# EAGLE design robber_v02 (EAGLE 8.3.1)
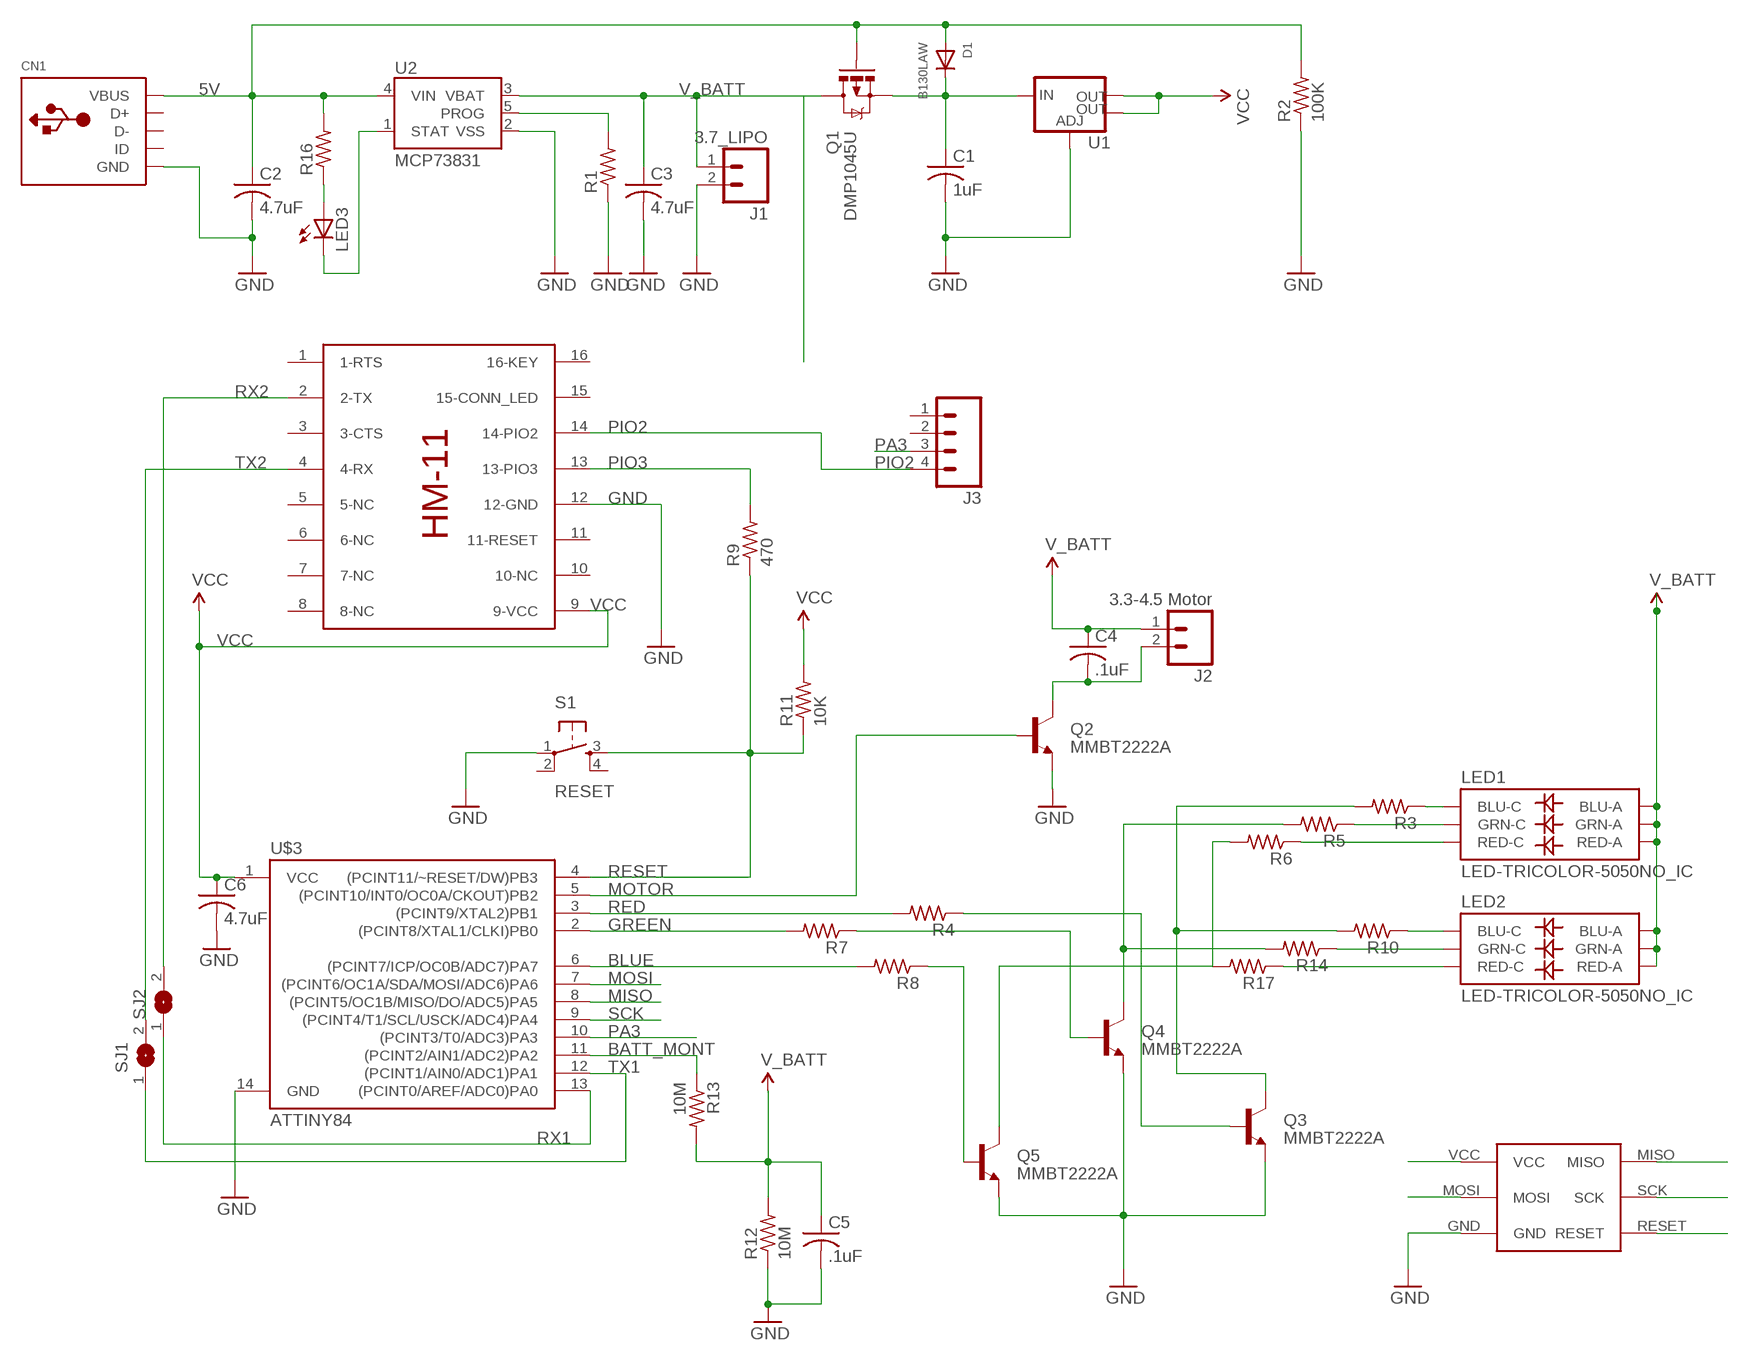
[diagram p0: schematic, sheet 1]

## Parts
C1  1uF  C-USC0805K  [C0805K]
C2  4.7uF  C-USC0805K  [C0805K]
C3  4.7uF  C-USC0805  [C0805]
C4  .1uF  C-USC0402K  [C0402K]
C5  .1uF  C-USC0805  [C0805]
C6  4.7uF  C-USC0805  [C0805]
CN1  USBMINIB  [USB-MINIB]
D1  B130LAW  DIODESOD-123  [SOD-123]
J1  3.7_LIPO  M02PTH  [1X02]
J2  3.3-4.5 Motor  M02PTH  [1X02]
J3  M04PTH  [1X04]
LED1  LED-TRICOLOR-5050NO_IC  [LED-TRICOLOR-5050]
LED2  LED-TRICOLOR-5050NO_IC  [LED-TRICOLOR-5050]
LED3  LEDSML0603  [SML0603]
Q1  DMP1045U  MOSFET-PCHANNEL  [SOT23-3]
Q2  MMBT2222A  TRANSISTOR_NPNMMBT2222A  [SOT23-3]
Q3  MMBT2222A  TRANSISTOR_NPNMMBT2222A  [SOT23-3]
Q4  MMBT2222A  TRANSISTOR_NPNMMBT2222A  [SOT23-3]
Q5  MMBT2222A  TRANSISTOR_NPNMMBT2222A  [SOT23-3]
R1  R-US_R0805W  [R0805W]
R2  100K  R-US_R0805W  [R0805W]
R3  R-US_R0402  [R0402]
R4  R-US_R0402  [R0402]
R5  R-US_R0402  [R0402]
R6  R-US_R0402  [R0402]
R7  R-US_R0402  [R0402]
R8  R-US_R0402  [R0402]
R9  470  R-US_R0805  [R0805]
R10  R-US_R0402  [R0402]
R11  10K  R-US_R0805W  [R0805W]
R12  10M  R-US_R0805W  [R0805W]
R13  10M  R-US_R0805W  [R0805W]
R14  R-US_R0402  [R0402]
R16  R-US_R0805W  [R0805W]
R17  R-US_R0402  [R0402]
S1  RESET  TAC_SWITCHSMD  [TACTILE-SWITCH-SMD]
SJ1  SJ  [SJ]
SJ2  SJ  [SJ]
U1  V_REG_LM1117SOT223  [SOT223]
U2  MCP73831  [SOT23-5]
U$1  HM-11  [HM-11]
U$3  ATTINY84  [SO14]
U$5  TINY-AVR-POGO-PIN-KEY  [TINY-AVR-POGO-PIN-KEY]

## Nets
5V: C2.1 CN1.VBUS D1.A Q1.1(G) R2.2 R16.2 U2.4(VIN)
BATT_MONT: R13.1 U$3.11((PCINT2/AIN1/ADC2)PA2)
BLUE: R8.2 U$3.6((PCINT7/ICP/OC0B/ADC7)PA7)
GND: C1.2 C2.2 C3.2 C5.2 C6.2 CN1.GND CN1.GND1(GND) CN1.GND2(GND) CN1.GND3(GND) CN1.GND4(GND) J1.2 Q2.2(E) Q3.2(E) Q4.2(E) Q5.2(E) R1.1 R2.1 R12.1 S1.1 U1.1(ADJ) U2.2(VSS) U$1.12(12-GND) U$3.14(GND) U$5.GND
GREEN: R7.2 U$3.2((PCINT8/XTAL1/CLKI)PB0)
MISO: U$3.8((PCINT5/OC1B/MISO/DO/ADC5)PA5) U$5.MISO
MOSI: U$3.7((PCINT6/OC1A/SDA/MOSI/ADC6)PA6) U$5.MOSI
MOTOR: Q2.1(B) U$3.5((PCINT10/INT0/OC0A/CKOUT)PB2)
N$1: LED3.A R16.1
N$2: LED3.C U2.1(STAT)
N$3: C1.1 D1.C Q1.2(S) U1.3(IN)
N$5: LED1.4(BLU-C) R3.1
N$6: LED1.6(GRN-C) R5.1
N$7: C4.2 J2.2 Q2.3(C)
N$8: LED1.5(RED-C) R6.1
N$9: LED2.4(BLU-C) R10.1
N$10: LED2.6(GRN-C) R14.1
N$11: LED2.5(RED-C) R17.1
N$12: Q3.3(C) R3.2 R10.2
N$13: Q3.1(B) R4.1
N$14: Q4.3(C) R5.2 R14.2
N$15: Q4.1(B) R7.1
N$18: Q5.1(B) R8.1
N$19: Q5.3(C) R6.2 R17.2
N$20: R1.2 U2.5(PROG)
PA3: J3.3 U$3.10((PCINT3/T0/ADC3)PA3)
PIO2: J3.4 U$1.14(14-PIO2)
PIO3: R9.2 U$1.13(13-PIO3)
RED: R4.2 U$3.3((PCINT9/XTAL2)PB1)
RESET: R9.1 R11.1 S1.3 U$3.4((PCINT11/~RESET/DW)PB3) U$5.RESET
RX1: SJ2.1 U$3.13((PCINT0/AREF/ADC0)PA0)
RX2: SJ2.2 U$1.2(2-TX)
SCK: U$3.9((PCINT4/T1/SCL/USCK/ADC4)PA4) U$5.SCK
TX1: SJ1.1 U$3.12((PCINT1/AIN0/ADC1)PA1)
TX2: SJ1.2 U$1.4(4-RX)
V_BATT: C3.1 C4.1 C5.1 J1.1 J2.1 LED1.1(GRN-A) LED1.2(RED-A) LED1.3(BLU-A) LED2.1(GRN-A) LED2.2(RED-A) LED2.3(BLU-A) Q1.3(D) R12.2 R13.2 U2.3(VBAT)
VCC: C6.1 R11.2 U1.2(OUT) U1.4(OUT) U$1.9(9-VCC) U$3.1(VCC) U$5.VCC
Unconnected: CN1.D+ CN1.D- CN1.ID J3.1 J3.2 S1.2 S1.4 U$1.1(1-RTS) U$1.3(3-CTS) U$1.5(5-NC) U$1.6(6-NC) U$1.7(7-NC) U$1.8(8-NC) U$1.10(10-NC) U$1.11(11-RESET) U$1.15(15-CONN_LED) U$1.16(16-KEY)

## Library data of the parts
C1-C6 = resistor:C-US: CAPACITOR, American symbol
CN1 = adafruit:USB: USB Connectors USBMINIB - Surface Mount Female Mini-B USB Connector 4UConnector: 06564 By microbuilder.eu Thru-hole RA Female Mini-B USB Connector 4UConnector: 18732 By ladyada.net
D1 = adafruit:DIODE: Diode SMADIODE - SMA Surface Mount Package 20V 1A Schottky Diode Digikey: 641-1014-6-ND DO-1N4148 - Through Hole Small Current Diode SOD-123 20V 1 A (.5mV Vf) Schottky Diode - Digikey: MBRX120TPMSCT-ND SOD-323 10V 570mA (.38mV Vf, 3ns) Schottky Diode - Digikey: ZLLS410CT-ND SOD-523 30V 30mA Schottky Diode (RB751S-40TE61) - Digikey: RB751S-40TE61CT-ND SOT23-R/W - SOT23 Package (R = Solder Paste/Reflow Ovens, W = Hand-Soldering) BAT54Film 40V 300mA - Digikey: 497-7162-1-ND
J1 J2 = SparkFun-Connectors:M02: Standard 2-pin 0.1" header. Use with - straight break away headers ( PRT-00116) - right angle break away headers (PRT-00553) - swiss pins (PRT-00743) - machine pins (PRT-00117) - female headers (PRT-00115) Molex polarized connector foot print use with: PRT-08233 with associated crimp pins and housings. 2.54_SCREWTERM for use with PRT-10571. 3.5mm Screw Terminal footprints for PRT-08084 5mm Screw Terminal footprints for use with PRT-08432
J3 = SparkFun-Connectors:M04: Header 4 Standard 4-pin 0.1" header. Use with straight break away headers (SKU : PRT-00116), right angle break away headers (PRT-00553), swiss pins (PRT-00743), machine pins (PRT-00117), and female headers (PRT-00115). Molex polarized connector foot print use with SKU : PRT-08231 with associated crimp pins and housings. 1MM SMD Version SKU: PRT-10208; PROD_ID: CONN-09696
LED1 LED2 = SparkFun-LED:LED-TRICOLOR-5050; PROD_ID: DIO-10298
LED3 = led:LED: LED OSRAM: - CHIPLED LG R971, LG N971, LY N971, LG Q971, LY Q971, LO R971, LY R971 LH N974, LH R974 LS Q976, LO Q976, LY Q976 LO Q996 - Hyper CHIPLED LW Q18S LB Q993, LB Q99A, LB R99A - SideLED LS A670, LO A670, LY A670, LG A670, LP A670 LB A673, LV A673, LT A673, LW A673 LH A674 LY A675 LS A676, LA A676, LO A676, LY A676, LW A676 LS A679, LY A679, LG A679 - Hyper Micro SIDELED® LS Y876, LA Y876, LO Y876, LY Y876 LT Y87S - SmartLED LW L88C, LW L88S LB L89C, LB L89S, LG L890 LS L89K, LO L89K, LY L89K LS L896, LA L896, LO L896, LY L896 - TOPLED LS T670, LO T670, LY T670, LG T670, LP T670 LSG T670, LSP T670, LSY T670, LOP T670, LYG T670 LG T671, LOG T671, LSG T671 LB T673, LV T673, LT T673, LW T673 LH T674 LS T676, LA T676, LO T676, LY T676, LB T676, LH T676, LSB T676, LW T676 LB T67C, LV T67C, LT T67C, LS T67K, LO T67K, LY T67K, LW E67C LS E67B, LA E67B, LO E67B, LY E67B, LB E67C, LV E67C, LT E67C LW T67C LS T679, LY T679, LG T679 LS T770, LO T770, LY T770, LG T770, LP T770 LB T773, LV T773, LT T773, LW T773 LH T774 LS E675, LA E675, LY E675, LS T675 LS T776, LA T776, LO T776, LY T776, LB T776 LHGB T686 LT T68C, LB T68C - Hyper Mini TOPLED® LB M676 - Mini TOPLED Santana® LG M470 LS M47K, LO M47K, LY M47K Source: http://www.osram.convergy.de LUXEON: - LUMILED® LXK2-PW12-R00, LXK2-PW12-S00, LXK2-PW14-U00, LXK2-PW14-V00 LXK2-PM12-R00, LXK2-PM12-S00, LXK2-PM14-U00 LXK2-PE12-Q00, LXK2-PE12-R00, LXK2-PE12-S00, LXK2-PE14-T00, LXK2-PE14-U00 LXK2-PB12-K00, LXK2-PB12-L00, LXK2-PB12-M00, LXK2-PB14-N00, LXK2-PB14-P00, LXK2-PB14-Q00 LXK2-PR12-L00, LXK2-PR12-M00, LXK2-PR14-Q00, LXK2-PR14-R00 LXK2-PD12-Q00, LXK2-PD12-R00, LXK2-PD12-S00 LXK2-PH12-R00, LXK2-PH12-S00 LXK2-PL12-P00, LXK2-PL12-Q00, LXK2-PL12-R00 Source: www.luxeon.com KINGBRIGHT: KA-3528ASYC Source: www.kingbright.com
Q1 = SparkFun-DiscreteSemi:MOSFET-PCHANNEL: Generic PMOSFET IRLML2244 - TRANS-11153 (SOT-23 -20V -4.3A) (1.Gate 2.Source 3.Drain) FQP27P06 - COM-10349 <http://www.sparkfun.com/products/10349> (TO-220 -60V -27A) (1.Gate 2.Source 3.Drain); PROD_ID: TRANS-08285
Q2-Q5 = SparkFun-DiscreteSemi:TRANSISTOR_NPN: Generic NPN BJT MMBT2222A - TRANS-08049 (SOT-23, 1A 40V) MPSA42 - TRANS-09116 (SOT-23, 500mA 300V) MMBT5088LT1G - TRANS-11160 (SOT-23, 50 mA 30V) BC547 - COM-08928 <http://www.sparkfun.com/products/8928> (TO-92 45V 100mA) (1.Collector 2.Base 3.Emitter) 2N3904 - COM-00521 <http://www.sparkfun.com/products/521> (TO-92 40V 200mA) (1.Emitter 2.Base 3.Collector) P2N2222A - COM-12852 <http://www.sparkfun.com/products/12852> (TO-92 40V 600mA) (1.Collector 2.Base 3.Emitter); PROD_ID: TRANS-08049
R1-R14 R16 R17 = resistor:R-US_: RESISTOR, American symbol
S1 = SparkFun-Retired:TAC_SWITCH: Momentary Switch Button commonly used for reset or general input. Spark Fun Electronics SKU : COM-00097 SMT- SWCH-08247; PROD_ID: SWCH-08247; VALUE: TAC_SWITCHSMD
SJ1 SJ2 = jumper:SJ: SMD solder JUMPER
U1 = SparkFun-IC-Power:V_REG_LM1117: Voltage Regulator LM1117 Standard adjustable voltage regulator but in SMD form. Spark Fun Electronics SKU : COM-00595; PROD_ID: VREG-08170
U2 = SparkFun-PowerIC:MCP73831: Miniature single cell, fully integrated Li-Ion, Li-polymer charge management controller http://ww1.microchip.com/downloads/en/DeviceDoc/20001984g.pdf IC-09995; PROD_ID: IC-09995
U$1 = HM-11-ladvien:HM-11
U$3 = SparkFun-DigitalIC:ATTINY84: Atmel 14-pin 2/4/8kB flash uC; PROD_ID: IC-11285
U$5 = Ladvien_Eagle_Parts:TINY-AVR-POGO-PIN-KEY

## Board
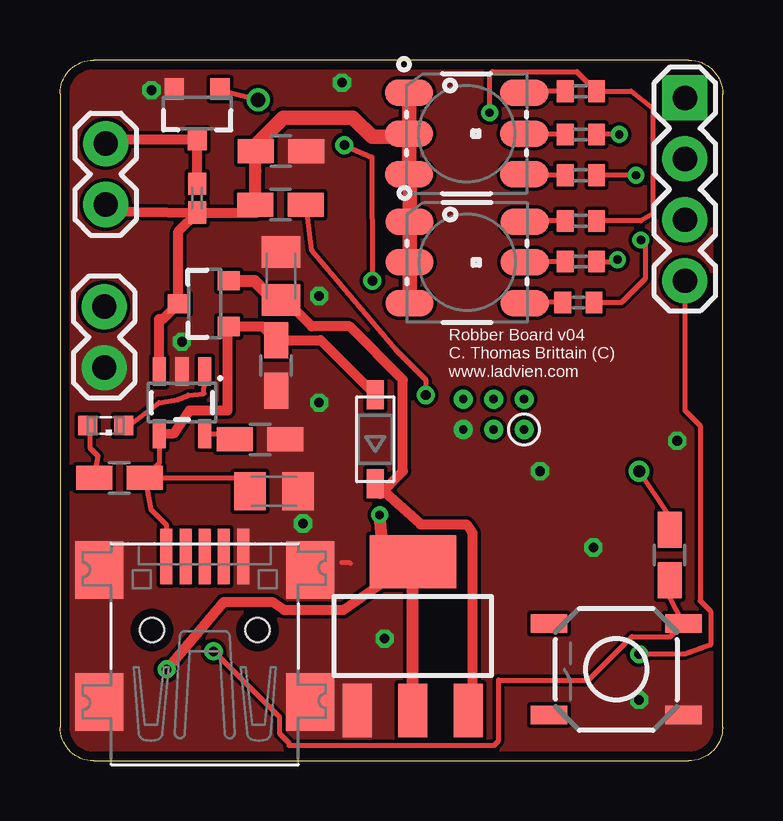
[diagram p1: board, top side]
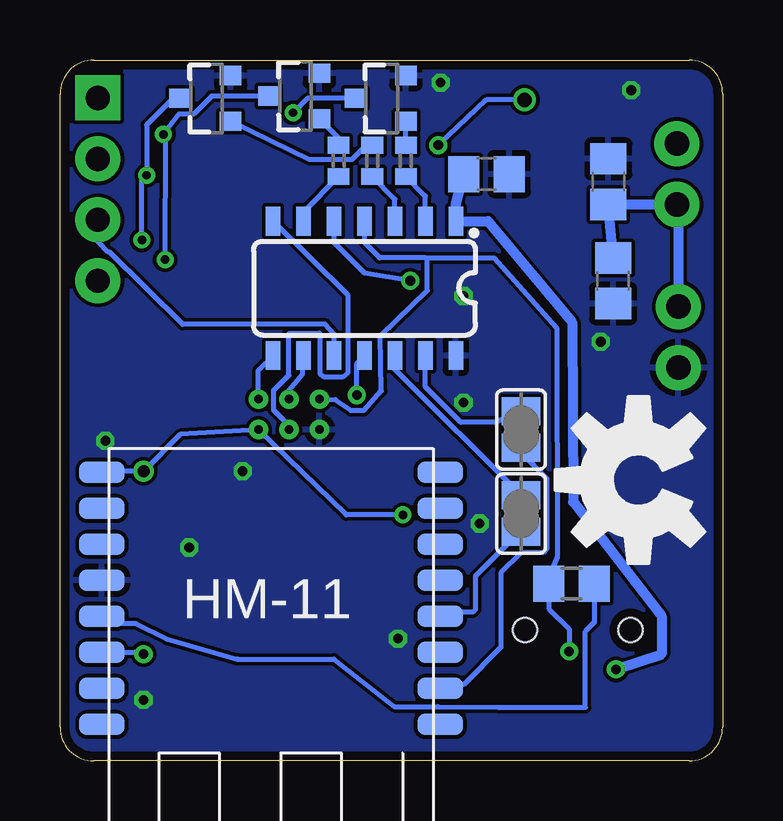
[diagram p2: board, bottom side, seen from below]

Size 27.61 x 29.2 mm. Coordinates in mm from the lower left corner, seen from the top.
Outline: 0,27.8 0,1.4 arc90 1.4,0 26.2,0 arc90 27.61,1.39 27.61,27.78 arc90 26.2,29.2 1.4,29.2 arc90 0,27.8
Copper layers (1*16): Top 0.0356mm / dielectric 1.5011mm / Bottom 0.0356mm
Design rules "LaenPCBOrder *": minimum track width 6mil, minimum drill 13mil, track to track 6mil, track to pad 6mil, pad to pad 6mil, via to via 6mil, smd to smd 6mil, copper to edge 15mil, drill to drill 6mil, minimum pad ring 7mil, minimum via ring 7mil, stop-mask expansion 3mil, vias tented up to drill 15.74803125mm, thermal gap 10mil

### Footprints (pad centres in the part's own frame; a part is rotated, then mirrored left to right if it is on the bottom)
C0805K = smd 1.3 x 1.6: 1 -1,0; 2 1,0
C0805 = smd 1.3 x 1.5: 1 -0.95,0; 2 0.95,0
C0402K = smd 0.925 x 0.74: 1 -0.6,0; 2 0.6,0
USB-MINIB = smd 0.5 x 2.308: D+ 0,4.064; D- -0.8,4.064; GND 1.6,4.064; ID 0.8,4.064; VBUS -1.6,4.064 | smd 2 x 2.4: GND1 -4.4,-2; GND2 -4.4,3.5; GND3 4.4,3.5; GND4 4.4,-2 | hole 1: -2.2,1; 2.2,1
SOD-123 = smd 1.2 x 0.7: A 1.85,0; C -1.85,0
1X02 = drill 1.016 pad 1.88: 1 0,0; 2 2.54,0
1X04 = drill 1.016 pad 1.88 square: 1 0,0 | drill 1.016 pad 1.88: 2 2.54,0; 3 5.08,0; 4 7.62,0
LED-TRICOLOR-5050 = smd 2 x 1.1: 1 -2.4,1.7; 2 -2.4,0; 3 -2.4,-1.7; 4 2.4,-1.7; 5 2.4,0; 6 2.4,1.7
SML0603 = smd 0.8 x 0.8: A 0.75,0; C -0.75,0
SOT23-3 = smd 0.8 x 0.9: 1 -0.95,-1; 2 0.95,-1; 3 0,1.1
R0805W = smd 1.5 x 1: 1 -1.052,0; 2 1.052,0
R0402 = smd 0.7 x 0.9: 1 -0.65,0; 2 0.65,0
R0805 = smd 1.3 x 1.5: 1 -0.95,0; 2 0.95,0
TACTILE-SWITCH-SMD = smd 1.524 x 0.762: 1 -2.794,1.905; 2 2.794,1.905; 3 -2.794,-1.905; 4 2.794,-1.905
SJ = smd 1.168 x 1.6: 1 -0.762,0; 2 0.762,0
SOT223 = smd 1.219 x 2.235: 1 -2.311,-3.099; 2 0,-3.099; 3 2.311,-3.099 | smd 3.6 x 2.2: 4 0,3.099
SOT23-5 = smd 0.55 x 1.2: 1 -0.95,-1.3; 2 0,-1.3; 3 0.95,-1.3; 4 0.95,1.3; 5 -0.95,1.3
HM-11 = smd 1.9 x 0.9: 1 -0.3,11.5; 2 -0.3,10; 3 -0.3,8.5; 4 -0.3,7; 5 -0.3,5.5; 6 -0.3,4; 7 -0.3,2.5; 8 -0.3,1; 9 13.8,1; 10 13.8,2.5; 11 13.8,4; 12 13.8,5.5; 13 13.8,7; 14 13.8,8.5; 15 13.8,10; 16 13.8,11.5
SO14 = smd 0.6 x 1.2: 1 -3.81,-2.8; 2 -2.54,-2.8; 3 -1.27,-2.8; 4 0,-2.8; 5 1.27,-2.8; 6 2.54,-2.8; 7 3.81,-2.8; 8 3.81,2.8; 9 2.54,2.8; 10 1.27,2.8; 11 0,2.8; 12 -1.27,2.8; 13 -2.54,2.8; 14 -3.81,2.8
TINY-AVR-POGO-PIN-KEY = drill 0.35 pad 0.8: GND 0,0; MISO 2.54,1.27; MOSI 1.27,0; RESET 0,1.27; SCK 1.27,1.27; VCC 2.54,0

### Placement (x,y rotation side)
C1  9.21,20.2 90 top
C2  8.91,11.23 0 top
C3  4.76,24.13 90 bottom
C4  5.71,23.44 90 top
C5  4.56,20 270 bottom
C6  9.84,24.45 0 bottom
CN1  6.03,4.45 0 top
D1  13.13,13.4 90 top
J1  1.84,18.92 270 top
J2  1.91,23.18 90 top
J3  26.04,27.62 270 top
LED1  16.96,20.77 0 top
LED2  16.95,26.14 0 top
LED3  1.91,13.97 180 top
Q1  6.03,19.05 90 top
Q2  5.71,26.99 180 top
Q3  21.5,27.6 90 bottom
Q4  14.2,27.6 90 bottom
Q5  17.8,27.7 90 bottom
R1  8.34,13.39 180 top
R2  9.01,16.48 90 top
R3  21.6,19.1 0 top
R4  14.6,25 270 bottom
R5  21.7,22.5 0 top
R6  21.7,20.8 0 top
R7  13.2,25 270 bottom
R8  16,25 270 bottom
R9  6.29,7.38 0 bottom
R10  21.7,24.4 0 top
R11  25.4,8.57 90 top
R12  9.21,25.4 180 top
R13  9.19,23.18 180 top
R14  21.7,27.9 0 top
R16  2.47,11.79 0 top
R17  21.7,26.1 0 top
S1  23.18,3.81 180 top
SJ1  8.4,10.3 270 bottom
SJ2  8.4,13.8 270 bottom
U1  14.7,5.2 0 top
U2  5.08,14.92 180 top
U$1  12.06,13.02 180 bottom
U$2  [OSHW-LOGO-L]  3.51,11.7 90 bottom
U$3  14.92,19.68 180 bottom
U$5  16.8,13.8 0 top

### Tracks (layer width: path | path; a pad name or v marks a point on that pad's centre or on a via)
5V
  Top 0.2: U2.4 4.13,12.39 R16.2 | 6.99,18.05 Q1.1 | CN1.VBUS 4.43,9.83 3.78,10.48 R16.2 | R16.2 7.36,11.79 C2.1
  Top 0.406: U2.4 4.76,13.65 5.4,14.61 6.99,14.61 6.99,18.05 | Q1.1 8.44,18.1 R2.2 10.86,17.53 D1.A
BATT_MONT  (via drill 0.4 pad 0.25)
  Top 0.2: R13.1 10.47,21.27 13.97,17.14 15.24,15.88 v15.24,15.24
  Bottom 0.2: v15.24,15.24 15.24,16.57 U$3.11
BLUE
  Bottom 0.203: U$3.6 17.46,22.89 R8.2
GND  (via drill 0.4)
  Top 0.2: 12.1,8.22 12.06,8.26 11.75,8.26
  other vias: 10.79,14.92 25.72,13.34 3.81,27.94 10.79,19.37 11.75,28.26 24.13,2.54 22.23,8.89 20,12.06 5.08,17.46 10.12,9.89 13.53,5.09
  pour Bottom: 0,0 -0.32,29.21 27.94,29.21 27.94,0
  pour Top (no thermals): 0,0 0,17.46 0,24.77 -0.32,29.84 27.94,29.84 27.94,0
GREEN
  Bottom 0.203: U$3.2 12.38,23.53 R7.2
MISO
  Bottom 0.2: U$5.MISO 19.34,16.28 U$3.8
MOSI
  Bottom 0.2: U$5.MOSI 18.07,13.98 18.71,14.61 18.71,15.43 18.07,16.06 18.07,17.81 16.79,17.82 16.78,16.14 16.63,16.01 15.81,16.01 15.6,16.17 15.6,19.4 U$3.7
MOTOR  (via drill 0.4 pad 0.25, 0.6)
  Top 0.2: Q2.1 6.71,27.94 v8.26,27.54 | v13.02,20 13,25.15 v11.85,25.65
  Bottom 0.2: v8.26,27.54 9.84,27.54 v11.85,25.65 | v13.02,20 14.92,20.32 16.19,21.59 U$3.5
N$1
  Top 0.2: R16.1 1.59,12.7 1.27,13.02 1.27,13.86 LED3.A
N$2
  Top 0.2: LED3.C 2.86,13.97 4.13,14.92 4.89,15.05 5.33,15.24 6,15.3 U2.1
N$3
  Top 0.2: 13.34,11.11 D1.C | 9.21,19.4 C1.1 | 10.48,18.1 10.48,18.13 | 17.16,9.55 17.18,9.49 | 17.18,2.1 U1.3
  Top 0.406: 10.48,18.1 12.06,18.1 14.29,15.88 14.29,12.06 13.34,11.11 | 10.48,18.13 9.21,19.4 | 17.16,9.55 16.95,9.86 15.03,9.86 D1.C | 17.18,9.49 17.18,2.1
  Top 0.508: Q1.2 8.1,20 8.7,19.4 9.21,19.4
N$5
  Top 0.203: R3.1 19.39,19.1 LED1.4
N$6
  Top 0.203: R5.1 19.39,22.5 LED1.6
N$7
  Top 0.2: 2.08,25.89 J2.2
  Top 0.406: C4.2 Q2.3 2.08,25.89
N$8
  Top 0.203: R6.1 19.39,20.8 LED1.5
N$9
  Top 0.203: R10.1 19.38,24.4 LED2.4
N$10
  Top 0.203: R14.1 19.41,27.9 LED2.6
N$11
  Top 0.203: R17.1 19.38,26.1 LED2.5
N$12  (via drill 0.35)
  Top 0.203: R3.2 23.4,19.1 24.4,20.1 24.4,21.5 v24.2,21.7 | v24,24.4 R10.2
  Bottom 0.203: v24.2,21.7 24.2,24.2 v24,24.4 24,26.5 22.9,27.6 Q3.3
N$13
  Bottom 0.203: R4.1 14.84,25.65 15.45,25.05 17.2,25.05 Q3.1
N$14  (via drill 0.35)
  Top 0.203: v17.9,27 17.9,28.6 18.02,28.72 21.53,28.72 R14.2 23.8,27.9 24.7,27.2 24.7,22.8 24.2,22.5 R5.2
  Bottom 0.203: Q4.3 17.3,27.6 v17.9,27
N$15
  Bottom 0.203: R7.1 Q4.1
N$18
  Bottom 0.203: R8.1 16,25.95 Q5.1
N$19  (via drill 0.35)
  Top 0.203: v23.3,26.1 R17.2 | R6.2 23.3,20.8 v23.23,20.88
  Bottom 0.203: Q5.3 21.29,27.7 22.05,26.95 22.65,26.95 v23.3,26.1 23.2,26 v23.23,20.88
N$20
  Top 0.2: U2.5 7.46,13.62 R1.2
PA3
  Bottom 0.203: U$3.10 16.19,17.78 16.56,18.2 22.5,18.18 25.54,21.2 25.6,21.2 26,21.6 26,22.51 J3.3
PIO2  (via drill 0.4 pad 0.25)
  Top 0.2: J3.4 26.04,14.61 26.67,13.97 26.67,6.67 27.11,6.22 27.11,4.83 26.04,4.45 v24.13,4.45
  Bottom 0.2: U$1.14 24.2,4.52 v24.13,4.45
PIO3
  Bottom 0.2: U$1.13 25.56,5.71 24.45,5.71 23.18,5.08 20.22,4.24 16.2,4.24 13.68,2.26 11.87,2.26 9.35,2.22 5.71,2.22 5.71,5.4 5.34,5.77 R9.2
RED
  Bottom 0.203: U$3.3 13.65,23.4 R4.2
RESET  (via drill 0.4 pad 0.25)
  Top 0.2: R11.1 25.34,6.92 S1.3 25.43,5.18 23.83,5.18 22.01,3.37 18.28,3.37 18.28,0.84 18.07,0.63 9.55,0.63 9.55,0.74 9.15,1.13 9.15,1.81 v6.4,4.56
  Bottom 0.2: 12.38,20.95 9.53,20.95 6.92,18.05 6.9,8.5 7.25,7.66 R9.1 7.25,6.34 6.4,5.5 v6.4,4.56 | 12.38,20.95 14.29,20.95 14.92,21.59 U$3.4 | U$5.RESET 16.14,15.05 15.5,14.6 14.94,14.6 14.22,15.41 14.27,17.72 12.3,19.6 12.3,20.88 12.38,20.95
RX1
  Bottom 0.2: U$3.13 12.38,15.58 10.9,14.1 9.46,14.1 SJ2.1
RX2
  Bottom 0.2: U$1.2 11.61,3.17 10.79,3.17 9.24,4.73 9.24,7.83 8.4,8.67 7.48,8.67 7.32,8.84 7.32,11.76 8.4,12.84 SJ2.2
SCK
  Bottom 0.2: U$5.SCK 18.06,15.44 17.5,16.11 17.5,16.85 U$3.9
TX1
  Bottom 0.2: 13.65,16.28 U$3.12 13.65,16.31 SJ1.1
TX2
  Bottom 0.2: SJ1.2 8.46,9.54 10.3,7.7 10.3,6.3 10.4,6.2 11.58,6.2 U$1.4
V_BATT
  Top 0.2: 1.99,22.89 J2.1 | 4.1,16.19 U2.3 | 4.13,18.41 | 8.21,22.84 R13.2 | R12.2 8.15,25.66
  Top 0.406: 1.99,22.89 C4.1 | U2.3 4.13,18.41 | 4.13,18.41 4.3,18.41 Q1.3 4.93,22.06 C4.1 | C4.1 8.21,22.84
  Top 0.508: R13.2 8.14,24.58 R12.2
  Top 0.61: 8.15,25.66 9.3,26.8 12.2,26.8 13,26 14.11,26 LED2.2 | LED2.1 LED2.2 | LED2.2 LED2.3 14.56,24.12 LED1.1 LED1.2 LED1.3
  Bottom 0.2: 1.89,23.13 1.84,22.99 | 1.89,23.13 J2.1 | 4.62,21.1 C5.1 | 1.84,23.09 1.89,23.13 | 1.94,23.18 1.89,23.13
  Bottom 0.406: C5.1 C3.1 1.94,23.18 | 1.84,23.09 J1.1
VCC  (via drill 0.35, 0.4 pad 0.25, 0.5)
  Top 0.2: v24.13,12.06 25.4,10.16 R11.2 25.32,9.6
  Top 0.406: v4.45,3.81 6.79,6.6 8.89,6.6 9.34,6.29 11.81,6.29 U1.4
  Top 0.508: U1.2 U1.4 13.4,8.3 13.4,9.4 13.38,9.52 v13.32,10.24
  Bottom 0.2: U$1.9 25.82,12.06 v24.13,12.06 22.59,13.6 U$5.VCC 15.69,10.24 v13.32,10.24
  Bottom 0.406: C6.1 11.11,23.18 U$3.1 9.79,22.48 6.27,18.27 6.23,10.79 2.54,6.03 2.54,4.45 v4.45,3.81

### Text on the board
_tsilk: Robber Board v04 / C. Thomas Brittain (C) / www.ladvien.com
_bsilk: PB0 | GND | PB1 | PA3 | VBAT | PI02 | GND